# EasyEDA Pro project ProProject_RTOS瑞士军刀_.epro

# Schematic Schematic1
Create Date: 2023-12-15; Page Name: P1; Project Name: RTOS瑞士军刀; Schematic Name: Schematic1; Update Date: 2023-12-18; Company: 嘉立创EDA; Page Size: A4; Version: V1.0
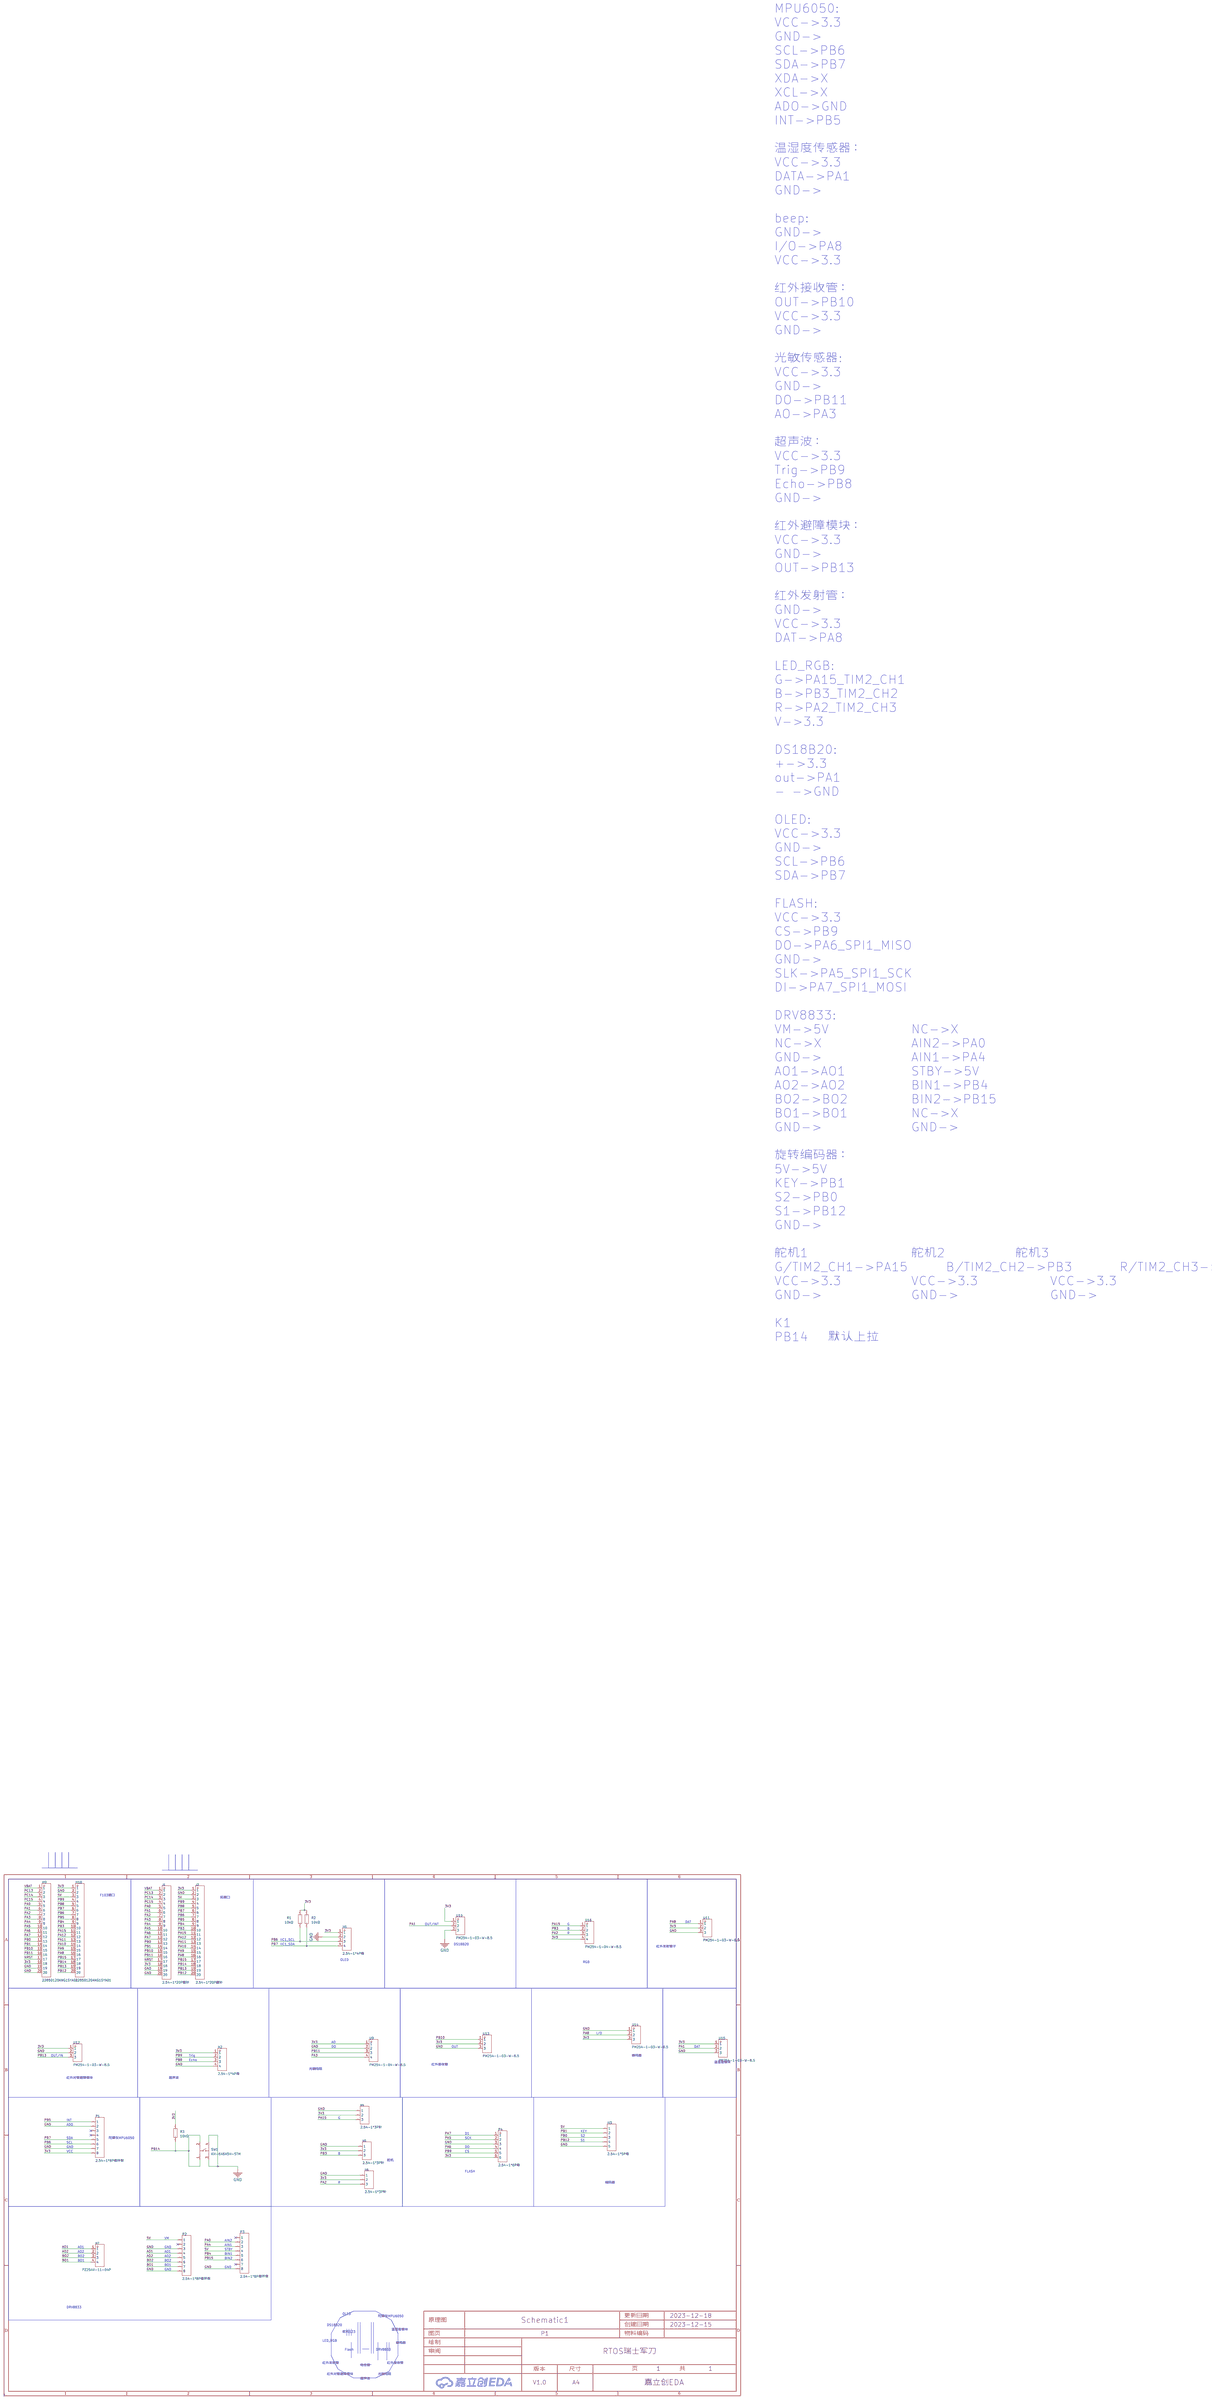
[diagram p0: schematic sheet]

## Parts
H1  2.54-1*4P母  [HDR-TH_4P-P2.54-V-F]
H2  2.54-1*4P母  [HDR-TH_4P-P2.54-V-F]
H3  2.54-1*5P母  [HDR-TH_5P-P2.54-V-F]
H4  2.54-1*3P针  [HDR-TH_3P-P2.54-V-M-1]
H5  2.54-1*3P针  [HDR-TH_3P-P2.54-V-M-1]
H6  2.54-1*3P针  [HDR-TH_3P-P2.54-V-M-1]
H7  PZ254V-11-04P  [HDR-TH_4P-P2.54-V-M]
H9  22850120ANG1SYA01  [HDR-TH_20P-P2.54-V-F]
H10  22850120ANG1SYA01  [HDR-TH_20P-P2.54-V-F]
J1  2.54-1*20P直针  [HDR-TH_20P-P2.54-V-M-1]
J2  2.54-1*20P直针  [HDR-TH_20P-P2.54-V-M-1]
P1  2.54-1*8P母环保  [HDR-TH_8P-P2.54-V-F-1]
P2  2.54-1*8P母环保  [HDR-TH_8P-P2.54-V-F-1]
P3  2.54-1*8P母环保  [HDR-TH_8P-P2.54-V-F-1]
P4  2.54-1*6P母  [HDR-TH_6P-P2.54-V-F]
R1  10kΩ  [R0603]
R2  10kΩ  [R0603]
R3  10kΩ  [R0603]
SW1  KH-6X6X5H-STM  [SW-SMD_4P-L6.0-W6.0-P4.50-LS9.0-2]
U9  PM254-1-04-W-8.5  [HDR-TH_4P-P2.54-H-F-W10.0-N]
U10  PM254-1-03-W-8.5  [HDR-TH_3P-P2.54-H-F-W10.0-N]
U11  PM254-1-03-W-8.5  [HDR-TH_3P-P2.54-H-F-W10.0-N]
U12  PM254-1-03-W-8.5  [HDR-TH_3P-P2.54-H-F-W10.0-N]
U13  PM254-1-03-W-8.5  [HDR-TH_3P-P2.54-H-F-W10.0-N]
U14  PM254-1-03-W-8.5  [HDR-TH_3P-P2.54-H-F-W10.0-N]
U15  PM254-1-03-W-8.5  [HDR-TH_3P-P2.54-H-F-W10.0-N]
U16  PM254-1-04-W-8.5  [HDR-TH_4P-P2.54-H-F-W10.0-N]

## Library data of the parts
H1 H2 = 2.54-1*4P母: 排数:单排;总孔位数:4P;间距:2.54mm;插孔结构:1x4P;行距:-;安装类型:直插;圆孔/方孔:方孔;额定电流:3A;额定电压:-;插孔方向:顶部;塑高:-;触头材质:青铜;触头镀层:-;工作温度范围:-40℃~+105℃;焊接温度(最大值):-;; LCSC Part Name: 间距:2.54mm 1x4P 直插; Supplier Part: C2718488; Manufacturer: BOOMELE(博穆精密); Supplier Footprint: 插件,P=2.54mm; JLCPCB Part Class: 扩展库; Datasheet: https://atta.szlcsc.com/upload/public/pdf/source/20210301/C2718488_F4427B881E42CAA8DDB0B1C12B3A522C.pdf; Supplier: LCSC; Number of Rows: 单排; Number of Holes: 4P; Pitch: 2.54mm; Holes Structure: 1x4P; Mounting Type: 直插; Circular Hole / Square Hole: 方孔; Current Rating (Max): 3A; Holes Direction: 顶部; Contact Material: 青铜; Operating Temperature Range: -40℃~+105℃
H3 = 2.54-1*5P母: 排数:单排;总孔位数:5P;间距:2.54mm;插孔结构:1x5P;行距:-;安装类型:直插;塑高:-;触头材质:-;触头镀层:-;; LCSC Part Name: 间距:2.54mm 1x5P 直插; Supplier Part: C50950; Manufacturer: BOOMELE(博穆精密); Supplier Footprint: 插件,P=2.54mm; JLCPCB Part Class: 扩展库; Datasheet: https://atta.szlcsc.com/upload/public/pdf/source/20210301/C2718488_F4427B881E42CAA8DDB0B1C12B3A522C.pdf; Supplier: LCSC; Number of Rows: 单排; Number of Holes: 5P; Pitch: 2.54mm; Holes Structure: 1x5P; Mounting Type: 直插
H4-H6 = 2.54-1*3P针: 排数:单排;总PIN位数:3;间距:2.54mm;插针结构:1x3P;行距:-;安装类型:直插;圆针/方针:方针;额定电流:3A;额定电压:-;配合针长度:-;塑高:-;端接针长度:-;触头材质:-;触头镀层:-;工作温度范围:-40℃~+105℃;颜色:黑色;; LCSC Part Name: 2.54mm 1x3P 直插 方针; Supplier Part: C49257; Manufacturer: BOOMELE(博穆精密); Supplier Footprint: 直插,P=2.54mm; JLCPCB Part Class: 扩展库; Supplier: LCSC; Number of Rows: 单排; Number of Pins: 3; Pitch: 2.54mm; Pin Structure: 1x3P; Mounting Type: 直插; Circluar Pins/Square Pins: 方针; Current Rating (Max): 3A; Operating Temperature Range: -40℃~+105℃; Color: 黑色
H7 = PZ254V-11-04P: 排数:单排;总PIN位数:4P;间距:2.54mm;插针结构:1x4P;行距:-;安装类型:直插;圆针/方针:方针;额定电流:3A;额定电压:250V;配合针长度:6mm;塑高:2.5mm;端接针长度:3mm;触头材质:-;工作温度范围:-40℃~+105℃;颜色:黑色;; LCSC Part Name: 2.54mm 1x4P 直插 方针; Supplier Part: C2691448; Manufacturer: XFCN(兴飞); Supplier Footprint: 插件,P=2.54mm; JLCPCB Part Class: 扩展库; Datasheet: https://atta.szlcsc.com/upload/public/pdf/source/20200309/C492403_F9F19131791D08044AD4F84F8E751A34.pdf; Supplier: LCSC; Number of Rows: 单排; Number of Pins: 4P; Pitch: 2.54mm; Pin Structure: 1x4P; Mounting Type: 直插; Circluar Pins/Square Pins: 方针; Current Rating (Max): 3A; Voltage Rating (Max): 250V; Length of Mating Pin: 6mm; Insulation Height: 2.5mm; Length of End Connection Pin: 3mm; Operating Temperature Range: -40℃~+105℃; Color: 黑色
H9 H10 = 22850120ANG1SYA01: 排数:单排;总孔位数:20P;间距:2.54mm;插孔结构:1x20P;行距:-;安装类型:直插;塑高:-;触头材质:黄铜;触头镀层:-;; LCSC Part Name: 间距:2.54mm 1x20P 直插; Supplier Part: C429947; Manufacturer: JILN(锦凌); Supplier Footprint: 插件,P=2.54mm; JLCPCB Part Class: 扩展库; Datasheet: https://atta.szlcsc.com/upload/public/pdf/source/20190920/C429966_F6288D72CB1EF194DAF75E8AC5D57877.pdf; Supplier: LCSC; Number of Rows: 单排; Number of Holes: 20P; Pitch: 2.54mm; Holes Structure: 1x20P; Mounting Type: 直插; Contact Material: 黄铜
J1 J2 = 2.54-1*20P直针: 排数:单排;总PIN位数:20;间距:2.54mm;插针结构:1x20P;行距:-;安装类型:直插;圆针/方针:方针;额定电流:3A;额定电压:-;配合针长度:-;塑高:-;端接针长度:-;触头材质:黄铜;触头镀层:-;工作温度范围:-40℃~+105℃;颜色:黑色;; LCSC Part Name: 2.54mm 1x20P 直插 方针; Supplier Part: C50981; Manufacturer: BOOMELE(博穆精密); Supplier Footprint: 直插,P=2.54mm; JLCPCB Part Class: 扩展库; Supplier: LCSC; Number of Rows: 单排; Number of Pins: 20; Pitch: 2.54mm; Pin Structure: 1x20P; Mounting Type: 直插; Circluar Pins/Square Pins: 方针; Current Rating (Max): 3A; Contact Material: 黄铜; Operating Temperature Range: -40℃~+105℃; Color: 黑色
P1-P3 = 2.54-1*8P母环保: 排数:单排;总孔位数:8P;间距:2.54mm;插孔结构:1x8P;行距:-;安装类型:直插;塑高:-;触头材质:-;触头镀层:-;; LCSC Part Name: 间距:2.54mm 1x8P 直插; Supplier Part: C27438; Manufacturer: BOOMELE(博穆精密); Supplier Footprint: 插件,P=2.54mm; JLCPCB Part Class: 扩展库; Datasheet: https://atta.szlcsc.com/upload/public/pdf/source/20210301/C2718488_F4427B881E42CAA8DDB0B1C12B3A522C.pdf; Supplier: LCSC; Number of Rows: 单排; Number of Holes: 8P; Pitch: 2.54mm; Holes Structure: 1x8P; Mounting Type: 直插
P4 = 2.54-1*6P母: 排数:单排;总孔位数:6P;间距:2.54mm;插孔结构:1x6P;行距:-;安装类型:直插;塑高:-;触头材质:-;触头镀层:-;; LCSC Part Name: 间距:2.54mm 1x6P 直插; Supplier Part: C40877; Manufacturer: BOOMELE(博穆精密); Supplier Footprint: 插件,P=2.54mm; JLCPCB Part Class: Extended Part; Datasheet: https://atta.szlcsc.com/upload/public/pdf/source/20210301/C2718488_F4427B881E42CAA8DDB0B1C12B3A522C.pdf; Supplier: LCSC; Number of Rows: 单排; Number of Holes: 6P; Pitch: 2.54mm; Holes Structure: 1x6P; Mounting Type: 直插
R1-R3 = 0603WAF1002T5E: 阻值:10kΩ;精度:±1%;功率:100mW;温度系数:±100ppm/℃;电阻类型:厚膜电阻;; LCSC Part Name: 10kΩ ±1% 100mW 厚膜电阻; Supplier Part: C25804; Manufacturer: UNI-ROYAL(厚声); Supplier Footprint: 0603; JLCPCB Part Class: 基础库; Datasheet: https://atta.szlcsc.com/upload/public/pdf/source/20200306/C422600_1E6D84923E4A46A82E41ADD87F860B5C.pdf; Supplier: LCSC; Tolerance: ±1%; Power(Watts): 100mW; Overload Voltage (Max): 75V; Temperature Coefficient: ±100ppm/℃; Type: 厚膜电阻; Operating Temperature Range: -55℃~+155℃
SW1 = KH-6X6X5H-STM: 电路结构:单刀单掷;带支架:否;触点电流:50mA;额定电压(DC):12V;安装方式:立贴;机械寿命:8万次;; LCSC Part Name: 6*6*5mm 立贴 轻触开关; Supplier Part: C2837531; Manufacturer: kinghelm(金航标); Supplier Footprint: SMD; JLCPCB Part Class: 扩展库; Datasheet: https://atta.szlcsc.com/upload/public/pdf/source/20210608/C2837531_45E87AB996CE723B09405FF2EA209C4C.pdf; Supplier: LCSC; Circuit: 单刀单掷; Actuator Style: 圆形按钮; Switch Length: 6mm; Switch Width: 6mm; Switch Height: 5mm; Strike Gundam: 否; Contact Current: 50mA; Voltage Rating (DC): 12V; Mounting Style: 立贴; Actuator/Cap Color: 黑色; Pin Style: 鸥翼型; Mechanical Life: 8万次
U9 U16 = PM254-1-04-W-8.5: 插孔结构:1x4P;间距:2.54mm;总孔位数:4P;安装类型:弯插;排数:单排;行距:-;圆孔/方孔:方孔;额定电流:3A;额定电压:-;插孔方向:侧面;塑高:8.5mm;工作温度范围:-40℃~+105℃;; LCSC Part Name: 间距:2.54mm 1x4P 弯插; Supplier Part: C2897386; Manufacturer: HCTL(华灿天禄); Supplier Footprint: 弯插,P=2.54mm; JLCPCB Part Class: 扩展库; Datasheet: https://atta.szlcsc.com/upload/public/pdf/source/20230609/7BA40A3D721268A082DCDEAD4C99131B.pdf; Supplier: LCSC; Holes Structure: 1x4P; Pitch: 2.54mm; Number of Holes: 4P; Mounting Type: 弯插; Number of Rows: 单排; Circular Hole / Square Hole: 方孔; Current Rating (Max): 3A; Holes Direction: 侧面; Insulation Height: 8.5mm; Operating Temperature Range: -40℃~+105℃
U10-U15 = PM254-1-03-W-8.5: 排数:单排;总孔位数:3P;间距:2.54mm;插孔结构:1x3P;行距:-;安装类型:弯插;圆孔/方孔:方孔;额定电流:3A;额定电压:-;插孔方向:侧面;塑高:8.5mm;工作温度范围:-40℃~+105℃;; LCSC Part Name: 间距:2.54mm 1x3P 弯插; Supplier Part: C2897385; Manufacturer: HCTL(华灿天禄); Supplier Footprint: 弯插,P=2.54mm; JLCPCB Part Class: 扩展库; Datasheet: https://atta.szlcsc.com/upload/public/pdf/source/20230609/7BA40A3D721268A082DCDEAD4C99131B.pdf; Supplier: LCSC; Number of Rows: 单排; Number of Holes: 3P; Pitch: 2.54mm; Holes Structure: 1x3P; Mounting Type: 弯插; Circular Hole / Square Hole: 方孔; Current Rating (Max): 3A; Holes Direction: 侧面; Insulation Height: 8.5mm; Operating Temperature Range: -40℃~+105℃

## Nets
3V3: H1.1 H2.1 H4.2 H5.2 H6.2 H9.18 H10.1 J1.18 J2.1 P1.8 P4.6 R1.2 R2.2 R3.2 U9.1 U10.1 U11.2 U12.1 U13.2 U14.3 U15.1 U16.4
5V: H3.1 H10.3 J2.3 P2.1 P3.4
GND: H1.2 H2.4 H3.5 H4.1 H5.1 H6.1 H9.19 H9.20 H10.2 J1.19 J1.20 J2.2 P1.2 P1.7 P2.3 P2.8 P3.8 P4.3 SW1.3 SW1.4 U9.2 U10.3 U11.3 U12.2 U13.3 U14.1 U15.3
VBAT: H9.1 J1.1
AO1: H7.1 P2.4
AO2: H7.2 P2.5
BO1: H7.4 P2.7
BO2: H7.3 P2.6
NRST: H9.17 J1.17
PA0: H9.5 J1.5 P3.2
PA1: H9.6 J1.6 U10.2 U15.2
PA2: H6.3 H9.7 J1.7 U16.3
PA3: H9.8 J1.8 U9.4
PA4: H9.9 J1.9 P3.3
PA5: H9.10 J1.10 P4.2
PA6: H9.11 J1.11 P4.4
PA7: H9.12 J1.12 P4.1
PA8: H10.16 J2.16 U11.1 U14.2
PA9: H10.15 J2.15
PA10: H10.14 J2.14
PA11: H10.13 J2.13
PA12: H10.12 J2.12
PA15: H4.3 H10.11 J2.11 U16.1
PB0: H3.3 H9.13 J1.13
PB1: H3.2 H9.14 J1.14
PB3: H5.3 H10.10 J2.10 U16.2
PB4: H10.9 J2.9 P3.5
PB5: H10.8 J2.8 P1.1
PB6: H1.3 H10.7 J2.7 P1.6 R1.1
PB7: H1.4 H10.6 J2.6 P1.5 R2.1
PB8: H2.3 H10.5 J2.5
PB9: H2.2 H10.4 J2.4 P4.5
PB10: H9.15 J1.15 U13.1
PB11: H9.16 J1.16 U9.3
PB12: H3.4 H10.20 J2.20
PB13: H10.19 J2.19 U12.3
PB14: H10.18 J2.18 R3.1 SW1.1 SW1.2
PB15: H10.17 J2.17 P3.6
PC13: H9.2 J1.2
PC14: H9.3 J1.3
PC15: H9.4 J1.4

Not connected (* = marked no-connect by the designer): P1 3* 4*; P2 2*; P3 1* 7*

## Notes on the sheet
- MPU6050:
  VCC->3.3
  GND->
  SCL->PB6
  SDA->PB7
  XDA->X
  XCL->X
  ADO->GND
  INT->PB5
  温湿度传感器：
  VCC->3.3
  DATA->PA1
  GND->
  beep:
  GND->
  I/O->PA8
  VCC->3.3
  红外接收管：
  OUT->PB10
  VCC->3.3
  GND->
  光敏传感器:
  VCC->3.3
  GND->
  DO->PB11
  AO->PA3
  超声波：
  VCC->3.3
  Trig->PB9
  Echo->PB8
  GND->
  红外避障模块：
  VCC->3.3
  GND->
  OUT->PB13
  红外发射管：
  GND->
  VCC->3.3
  DAT->PA8
  LED_RGB:
  G->PA15_TIM2_CH1
  B->PB3_TIM2_CH2
  R->PA2_TIM2_CH3
  V->3.3
  DS18B20:
  +->3.3
  out->PA1
  - ->GND
  OLED:
  VCC->3.3
  GND->
  SCL->PB6
  SDA->PB7
  FLASH:
  VCC->3.3
  CS->PB9
  DO->PA6_SPI1_MISO
  GND->
  SLK->PA5_SPI1_SCK
  DI->PA7_SPI1_MOSI
  DRV8833:
  VM->5V			NC->X
  NC->X			AIN2->PA0
  GND->			AIN1->PA4
  AO1->AO1		STBY->5V
  AO2->AO2		BIN1->PB4
  BO2->BO2		BIN2->PB15
  BO1->BO1		NC->X
  GND->			GND->
  旋转编码器：
  5V->5V
  KEY->PB1
  S2->PB0
  S1->PB12
  GND->
  舵机1			舵机2			舵机3
  G/TIM2_CH1->PA15	B/TIM2_CH2->PB3		R/TIM2_CH3->PA2
  VCC->3.3		VCC->3.3		VCC->3.3
  GND->			GND->			GND->
  K1
  PB14   默认上拉
- F103插口
- 拓展口
- OUT/INT
- G
- DAT
- B
- R
- IIC1_SCL
- IIC1_SDA
- DS18B20
- 红外发射管子
- OLED
- RGB
- I/O
- AO
- DO
- OUT
- DAT
- OUT/IN
- Trig
- 蜂鸣器
- Echo
- 红外接收管
- 温湿度模块
- 光敏电阻
- 红外对管避障模块
- 超声波
- G
- ADO
- INT
- D1
- KEY
- SDA
- 陀螺仪MPU6050
- SCK
- S1
- S2
- SCL
- GND
- DO
- VCC
- B
- CS
- 舵机
- FLASH
- R
- 编码器
- VM
- AIN2
- AIN1
- AO1
- GND
- STBY
- AO2
- BO2
- AO1
- AO2
- BIN1
- BO1
- BO2
- BIN2
- BO1
- GND
- GND
- DRV8833
- OLED
- 陀螺仪MPU6050
- DS18B20
- 温湿度模块
- 舵机123
- LED_RGB
- 蜂鸣器
- Flash
- DRV8833
- 红外发射管
- 电位器
- 红外接收管
- 红外对管避障模块
- 光敏电阻
- 超声波

# Board PCB1
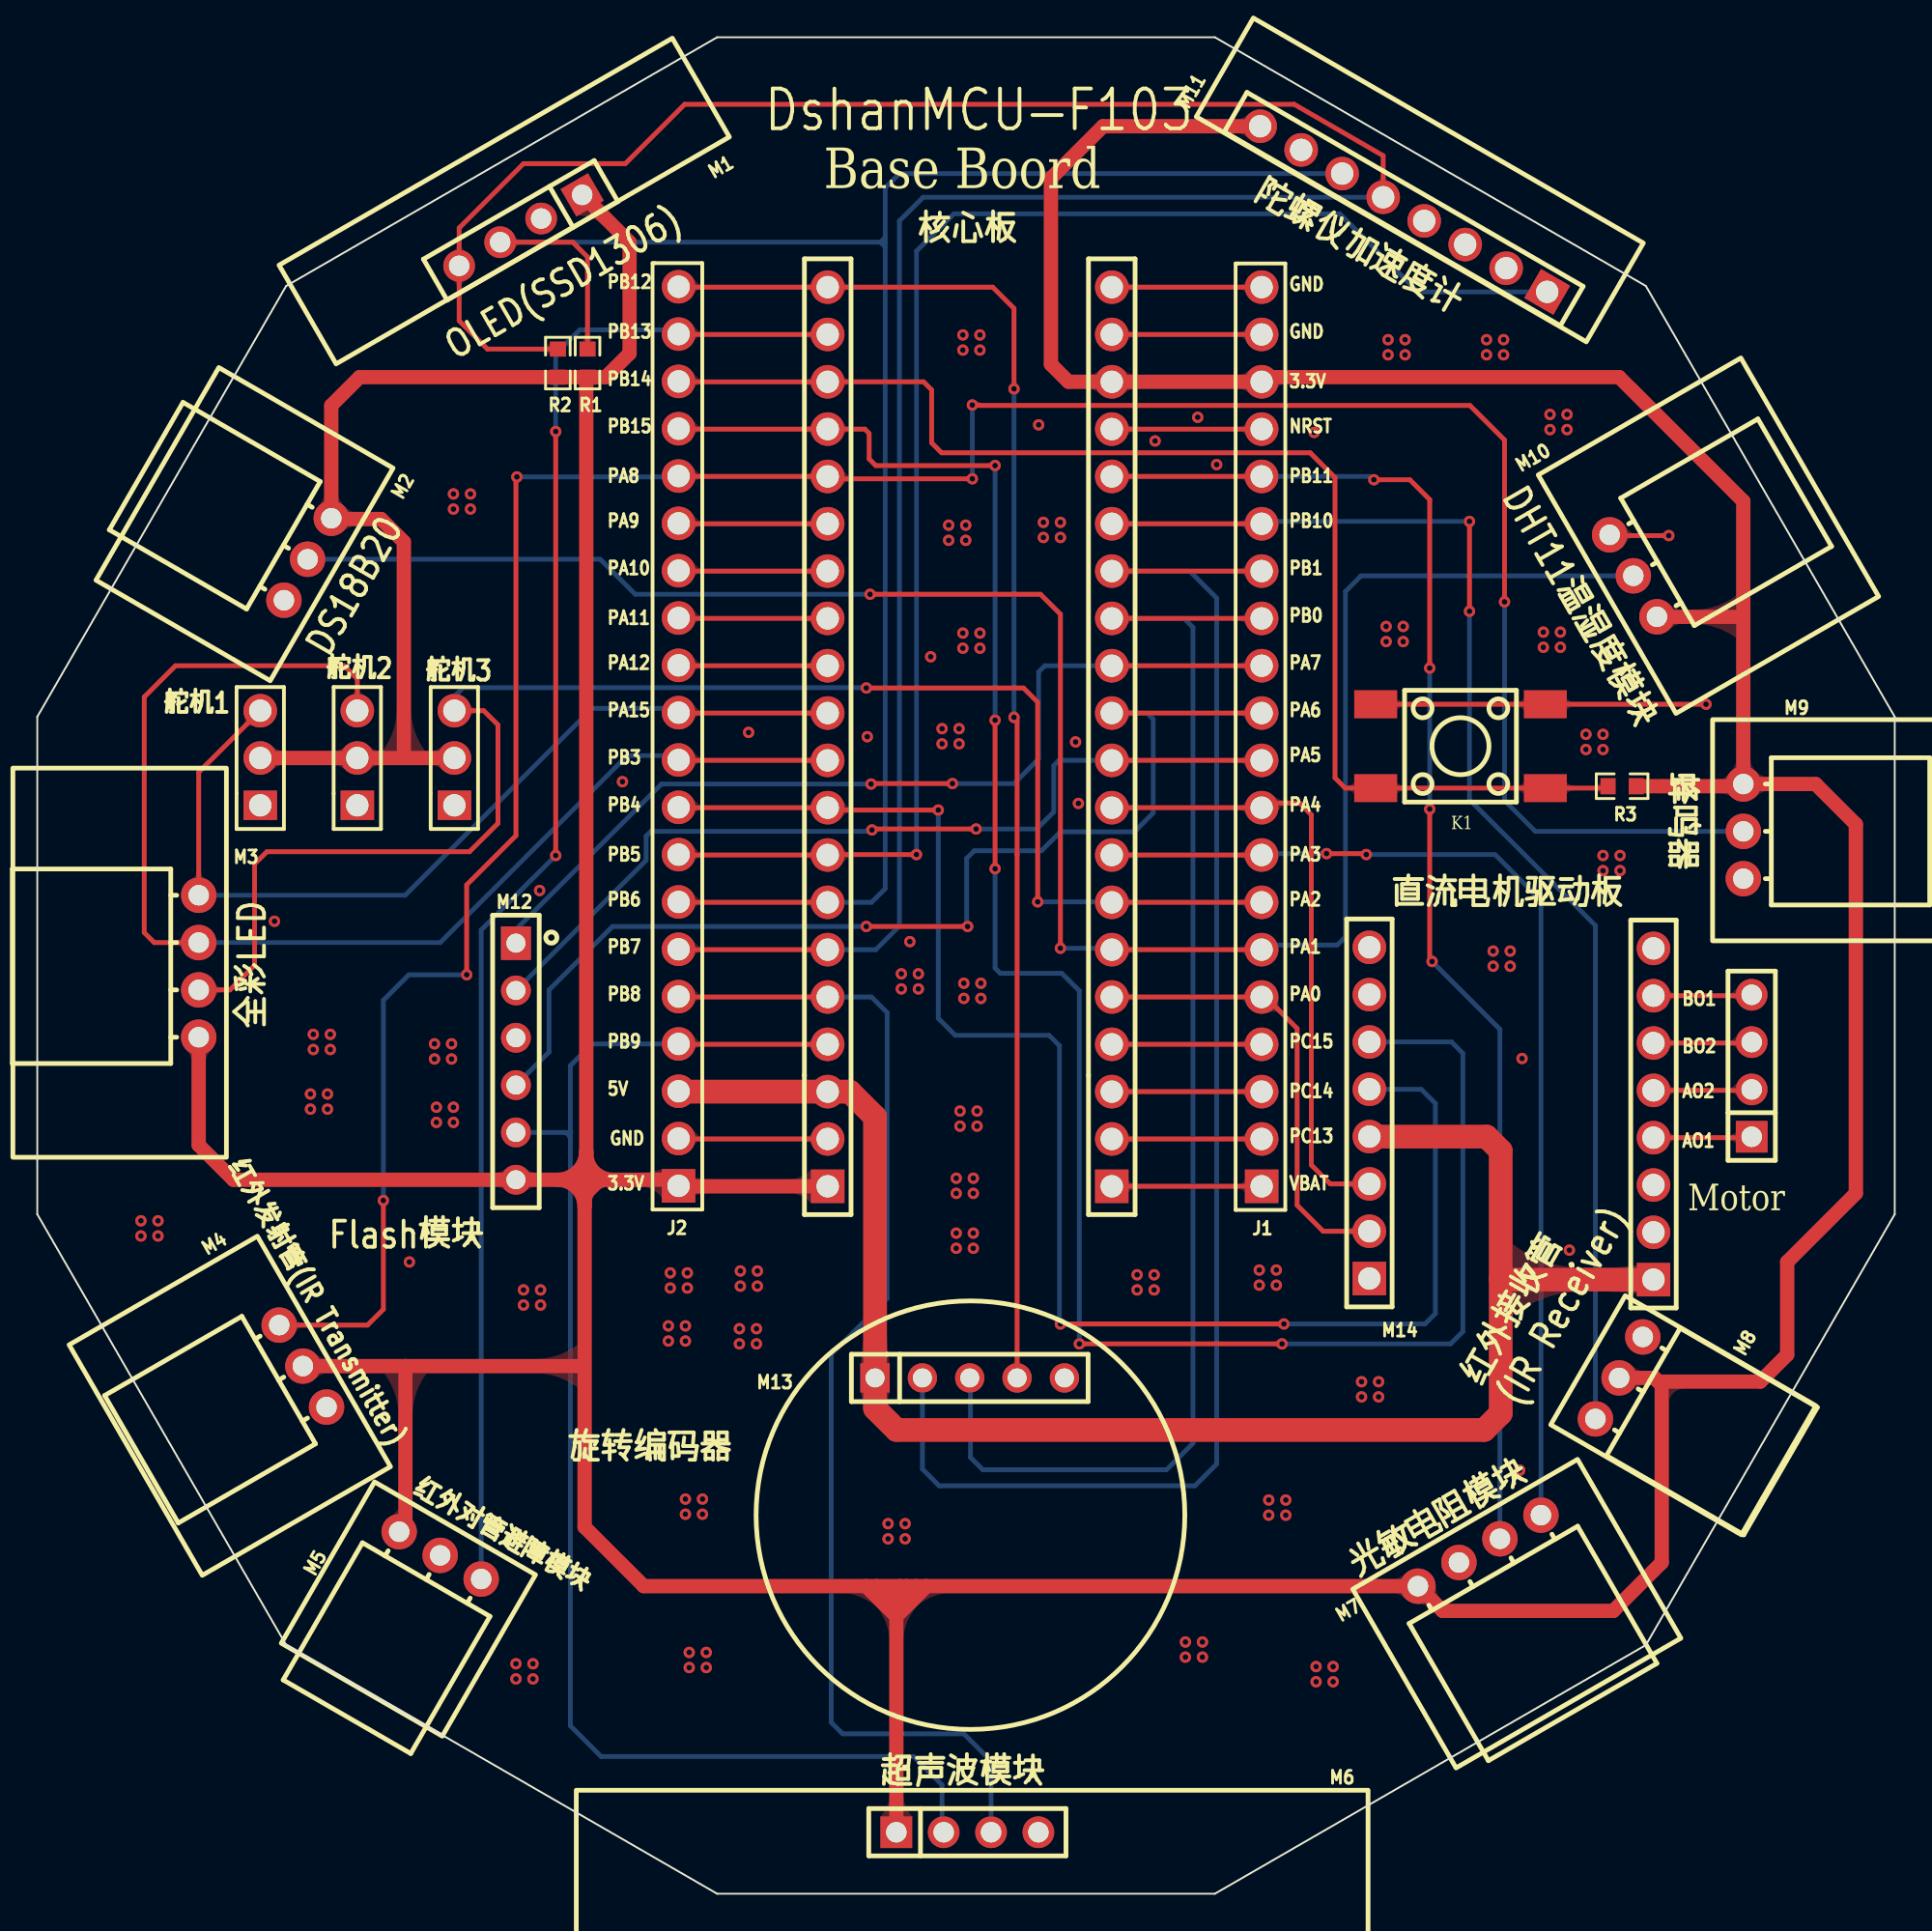
[diagram p1: board, top side]
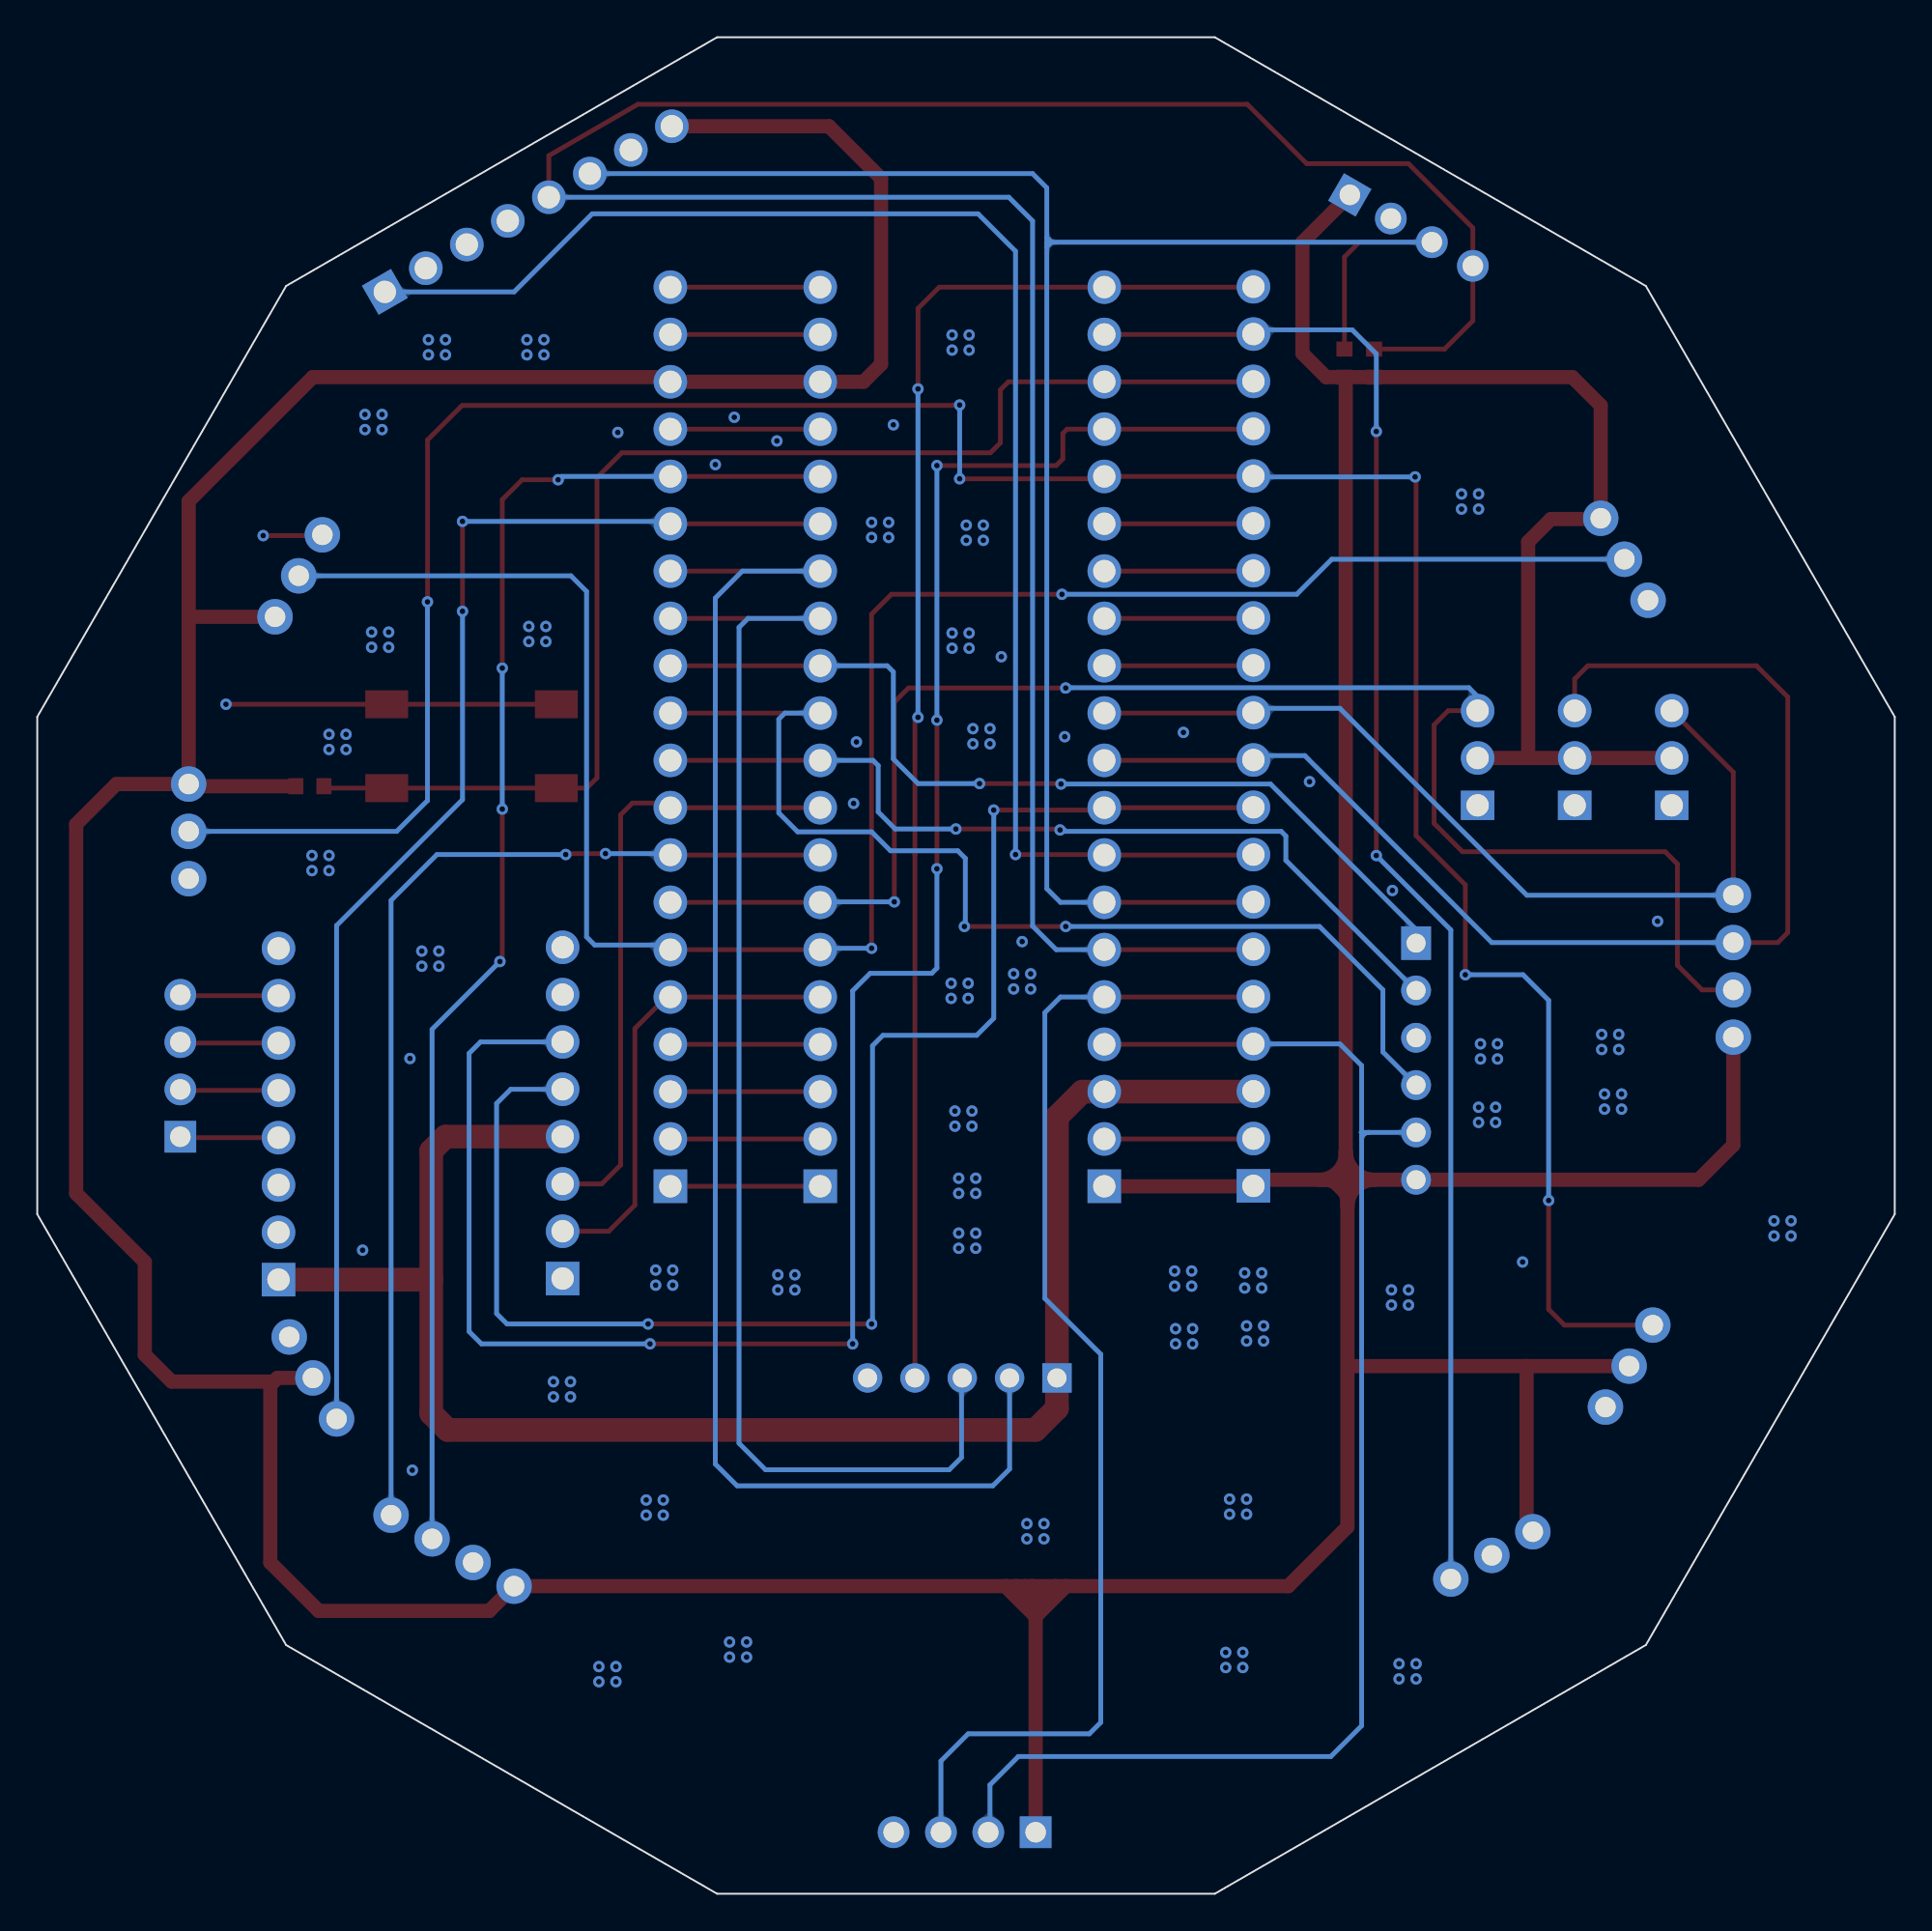
[diagram p2: board, bottom side, seen from below]

Outline 99.65 x 99.65 mm; copper layers: Top Layer, Bottom Layer. Coordinates in mm from the lower left corner of the outline.
Outline path: 0,63.17 0,36.47 13.35,13.35 36.47,0 63.17,0 86.3,13.35 99.65,36.47 99.65,63.17 86.3,86.3 63.17,99.65 36.47,99.65 13.35,86.3 0,63.17
Stack: Top Layer 0.035mm / Dielectric1 1.51mm FR4 er 4.5 / Bottom Layer 0.035mm

## Design rules (mm)
template: JLCPCB Capability(Two Layers Board)
spacing copperThickness1oz (default): track to track 0.102, other pairs 0.152 to 0.3
spacing copperThickness2oz: track to track 0.203, other pairs 0.152 to 0.3
track width copperThickness1oz (default): min 0.127, default 0.254, max 2.54
track width copperThickness2oz: min 0.203, default 0.254, max 2.54
differential pair differentialPair (default): width min 0.127, default 0.254, max 2.54; gap min 0.152, default 0.152
via viaSize (default): diameter min 0.5, default 0.61, max 10; hole min 0.3, default 0.305, max 6.3

## Placement (name value [footprint] x y rotation side)
H4  2.54-1*3P针  [HDR-TH_3P-P2.54-V-M-1]  11.96 60.96 90 top
H5  2.54-1*3P针  [HDR-TH_3P-P2.54-V-M-1]  17.17 60.96 90 top
H6  2.54-1*3P针  [HDR-TH_3P-P2.54-V-M-1]  22.38 60.96 90 top
H7  PZ254V-11-04P  [HDR-TH_4P-P2.54-V-M]  91.97 44.44 90 top
H9  22850120ANG1SYA01  [HDR-TH_20P-P2.54-V-F]  57.64 62.1 90 top
H10  22850120ANG1SYA01  [HDR-TH_20P-P2.54-V-F]  42.4 62.1 90 top
J1  2.54-1*20P直针  [HDR-TH_20P-P2.54-V-M-1]  65.68 62.1 90 top
J2  2.54-1*20P直针  [HDR-TH_20P-P2.54-V-M-1]  34.4 62.12 90 top
M1  2.54-1*4P母  [HDR-TH_4P-P2.54-V-F]  25.93 89.28 210 top
M2  PM254-1-03-W-8.5  [HDR-TH_3P-P2.54-H-F-W10.0-N]  14.5 71.63 240 top
M3  PM254-1-04-W-8.5  [HDR-TH_4P-P2.54-H-F-W10.0-N]  8.66 49.78 270 top
M4  PM254-1-03-W-8.5  [HDR-TH_3P-P2.54-H-F-W10.0-N]  14.25 28.32 300 top
M5  PM254-1-03-W-8.5  [HDR-TH_3P-P2.54-H-F-W10.0-N]  21.61 18.16 330 top
M6  2.54-1*4P母  [HDR-TH_4P-P2.54-V-F]  49.9 3.3 0 top
M7  PM254-1-04-W-8.5  [HDR-TH_4P-P2.54-H-F-W10.0-N]  77.37 18.41 30 top
M8  PM254-1-03-W-8.5  [HDR-TH_3P-P2.54-H-F-W10.0-N]  84.86 27.69 60 top
M9  PM254-1-03-W-8.5  [HDR-TH_3P-P2.54-H-F-W10.0-N]  91.53 57.02 90 top
M10  PM254-1-03-W-8.5  [HDR-TH_3P-P2.54-H-F-W10.0-N]  85.62 70.74 120 top
M11  2.54-1*8P母环保  [HDR-TH_8P-P2.54-V-F-1]  73.3 90.42 150 top
M12  2.54-1*6P母  [HDR-TH_6P-P2.54-V-F]  25.68 44.67 270 top
M13  2.54-1*5P母  [HDR-TH_5P-P2.54-V-F]  50.02 27.69 0 top
M14  2.54-1*8P母环保  [HDR-TH_8P-P2.54-V-F-1]  71.46 41.91 90 top
P2  2.54-1*8P母环保  [HDR-TH_8P-P2.54-V-F-1]  86.7 41.85 90 top
R1  10kΩ  [R0603]  29.52 82.16 270 top
R2  10kΩ  [R0603]  27.93 82.16 270 top
R3  10kΩ  [R0603]  85.02 59.45 0 top
SW1  KH-6X6X5H-STM  [SW-SMD_4P-L6.0-W6.0-P4.50-LS9.0-2]  76.35 61.59 180 top

## Footprints (pads in the part's own frame, mm; a bottom-side part is the same pattern mirrored in y, then rotated)
HDR-TH_3P-P2.54-H-F-W10.0-N
  round 1.9 hole 1.1: 1(-2.54,0) 2(0,0) 3(2.54,0)
HDR-TH_3P-P2.54-V-M-1
  rect 1.575x1.8 hole 1.2: 1(-2.54,0)
  round 1.8 hole 1.2: 2(0,0) 3(2.54,0)
HDR-TH_4P-P2.54-H-F-W10.0-N
  round 1.9 hole 1.1: 1(-3.81,0) 2(-1.27,0) 3(1.27,0) 4(3.81,0)
HDR-TH_4P-P2.54-V-F
  rect 1.7x1.7 hole 1.1: 1(-3.81,0)
  round 1.7 hole 1.1: 2(-1.27,0) 3(1.27,0) 4(3.81,0)
HDR-TH_4P-P2.54-V-M
  rect 1.7x1.7 hole 1.1: 1(-3.81,0)
  round 1.7 hole 1.1: 2(-1.27,0) 3(1.27,0) 4(3.81,0)
HDR-TH_5P-P2.54-V-F
  rect 1.575x1.575 hole 1.02: 1(-5.08,0)
  round 1.575 hole 1.02: 2(-2.54,0) 3(0,0) 4(2.54,0) 5(5.08,0)
HDR-TH_6P-P2.54-V-F
  rect 1.8x1.6 hole 1.02: 1(-6.35,0)
  round 1.6 hole 1.02: 2(-3.81,0) 3(-1.27,0) 4(1.27,0) 5(3.81,0) 6(6.35,0)
HDR-TH_8P-P2.54-V-F-1
  rect 1.8x1.8 hole 1.2: 1(-8.89,0)
  round 1.8 hole 1.2: 2(-6.35,0) 3(-3.81,0) 4(-1.27,0) 5(1.27,0) 6(3.81,0) 7(6.35,0) 8(8.89,0)
HDR-TH_20P-P2.54-V-F
  rect 1.8x1.8 hole 1.2: 1(-24.13,0)
  round 1.8 hole 1.2: 2(-21.59,0) 3(-19.05,0) 4(-16.51,0) 5(-13.97,0) 6(-11.43,0) 7(-8.89,0) 8(-6.35,0) 9(-3.81,0) 10(-1.27,0) 11(1.27,0) 12(3.81,0) 13(6.35,0) 14(8.89,0) 15(11.43,0) 16(13.97,0) 17(16.51,0) 18(19.05,0) 19(21.59,0) 20(24.13,0)
HDR-TH_20P-P2.54-V-M-1
  rect 1.8x1.8 hole 1.2: 1(-24.13,0)
  round 1.8 hole 1.2: 2(-21.59,0) 3(-19.05,0) 4(-16.51,0) 5(-13.97,0) 6(-11.43,0) 7(-8.89,0) 8(-6.35,0) 9(-3.81,0) 10(-1.27,0) 11(1.27,0) 12(3.81,0) 13(6.35,0) 14(8.89,0) 15(11.43,0) 16(13.97,0) 17(16.51,0) 18(19.05,0) 19(21.59,0) 20(24.13,0)
R0603
  rect 0.806x0.864 smd: 1(-0.753,0) 2(0.753,0)
SW-SMD_4P-L6.0-W6.0-P4.50-LS9.0-2
  rect 2.3x1.5 smd: 1(-4.55,2.25) 2(4.55,2.25) 3(-4.55,-2.25) 4(4.55,-2.25)

## Nets
3V3: H4.2 H5.2 H6.2 H9.18 H10.1 J1.18 J2.1 M1.1 M2.1 M3.4 M4.2 M5.1 M6.1 M7.1 M8.2 M9.3 M10.1 M11.8 M12.6 R1.2 R2.2 R3.2
5V: H10.3 J2.3 M13.1 M14.4 P2.1
GND: H4.1 H5.1 H6.1 H9.19 H9.20 H10.2 J1.19 J1.20 J2.2 M1.2 M2.3 M4.3 M5.2 M6.4 M7.2 M8.3 M9.1 M10.3 M11.2 M11.7 M12.3 M13.5 M14.8 P2.3 P2.8 SW1.3 SW1.4
VBAT: H9.1 J1.1
AO1: H7.1 P2.4
AO2: H7.2 P2.5
BO1: H7.4 P2.7
BO2: H7.3 P2.6
NRST: H9.17 J1.17
PA0: H9.5 J1.5 M14.2
PA1: H9.6 J1.6 M2.2 M10.2
PA2: H6.3 H9.7 J1.7 M3.3
PA3: H9.8 J1.8 M7.4
PA4: H9.9 J1.9 M14.3
PA5: H9.10 J1.10 M12.2
PA6: H9.11 J1.11 M12.4
PA7: H9.12 J1.12 M12.1
PA8: H10.16 J2.16 M4.1 M9.2
PA9: H10.15 J2.15
PA10: H10.14 J2.14
PA11: H10.13 J2.13
PA12: H10.12 J2.12
PA15: H4.3 H10.11 J2.11 M3.1
PB0: H9.13 J1.13 M13.3
PB1: H9.14 J1.14 M13.2
PB3: H5.3 H10.10 J2.10 M3.2
PB4: H10.9 J2.9 M14.5
PB5: H10.8 J2.8 M11.1
PB6: H10.7 J2.7 M1.3 M11.6 R1.1
PB7: H10.6 J2.6 M1.4 M11.5 R2.1
PB8: H10.5 J2.5 M6.3
PB9: H10.4 J2.4 M6.2 M12.5
PB10: H9.15 J1.15 M8.1
PB11: H9.16 J1.16 M7.3
PB12: H10.20 J2.20 M13.4
PB13: H10.19 J2.19 M5.3
PB14: H10.18 J2.18 R3.1 SW1.1 SW1.2
PB15: H10.17 J2.17 M14.6
PC13: H9.2 J1.2
PC14: H9.3 J1.3
PC15: H9.4 J1.4

Pads without a net: M11 3 4; M14 1 7; P2 2

## Via types
v1: diameter 0.61, hole 0.305, Top Layer to Bottom Layer, 213 vias

## Routing (per net, layer and track width the routed paths; a pad name or vN(x,y) marks a point on that pad's centre or on a via; arc(x,y) is an arc through that point)
3V3: length 425.3
  Top Layer w0.254: 17.55,60.96 H5.2 ; 34.3,38.32 34.4,38.22
  Top Layer w0.762: 19.67,60.96 H6.2 ; 19.67,60.96 19.67,72.56 18.44,73.79 15.81,73.79 M2.1 15.77,79.88 17.29,81.4 R2.2 29.45,81.4 ; 19.67,60.96 17.55,60.96 ; 29.36,37.52 29.36,38.32 ; 29.36,37.52 28.56,38.32 ; 29.36,37.52 29.51,37.67 ; 29.36,37.52 29.36,37.08 ; 29.36,38.32 28.56,38.32 ; 29.36,38.32 29.36,38.63 29.45,38.72 ; 29.45,38.94 29.45,38.72 ; 29.45,38.94 30.07,38.32 ; 29.45,38.94 29.45,39.18 ; 29.45,38.72 29.45,38.41 29.36,38.32 30.07,38.32 ; 29.45,39.86 29.45,39.75 ; 29.45,39.86 29.45,81.4 ; 29.45,39.86 arc(29,38.77) 27.91,38.32 ; 29.45,39.75 29.45,39.18 ; 29.45,39.75 arc(29.87,38.74) 30.88,38.32 ; 29.45,39.18 28.88,38.61 ; 45.03,16.51 44.46,16.51 ; 45.03,16.51 46.28,16.51 ; 45.03,16.51 46.09,15.46 ; 44.46,16.51 32.54,16.51 29.36,19.69 29.36,36.88 ; 44.46,16.51 46.09,14.88 ; M11.8 57.17,94.87 54.38,92.08 54.38,82.09 55.32,81.15 H9.18 65.39,81.15 65.64,81.4 84.86,81.4 91.53,74.74 91.53,68.58 ; M9.3 91.41,59.45 R3.2 ; M9.3 95.4,59.56 97.56,57.4 97.56,37.59 93.88,33.91 93.88,28.93 92.43,27.49 86.96,27.49 ; M9.3 91.53,68.58 ; 27.91,38.32 M12.6 10.52,38.32 8.66,40.18 M3.4 ; 27.91,38.32 28.56,38.32 ; 27.91,38.32 arc(28.94,37.9) 29.36,36.88 ; 46.28,16.51 46.09,16.32 46.09,15.46 ; 46.28,16.51 46.63,16.51 ; 30.6,38.32 30.88,38.32 ; 30.6,38.32 30.07,38.32 ; 30.6,38.32 arc(30.3,38.29) 30.02,38.18 ; 30.88,38.32 34.3,38.32 ; 47.14,16.51 47.69,16.51 ; 47.14,16.51 46.63,16.51 ; 47.14,16.51 46.89,16.26 ; 47.69,16.51 47.69,16.48 46.09,14.88 ; 47.69,16.51 M7.1 75.4,15.18 84.54,15.18 87.15,17.78 87.15,27.31 86.96,27.49 ; 46.09,14.88 M6.1 ; 46.09,14.88 46.09,15.46 ; 86.96,27.49 86.77,27.69 M8.2 ; 46.63,16.51 46.89,16.26 ; M5.1 19.75,19.77 19.75,28.32 ; 46.09,15.46 46.89,16.26 ; 29.45,81.4 R1.2 30.5,81.4 31.77,82.68 31.77,88.64 M1.1 ; 91.53,68.58 91.48,68.54 M10.1 ; 30.07,38.32 30.07,38.23 30.02,38.18 ; 29.51,37.67 30.02,38.18 ; 29.51,37.67 arc(29.4,37.38) 29.36,37.08 ; 29.51,37.67 arc(29.73,37.96) 30.02,38.18 ; 29.36,37.08 29.36,36.88 ; H10.1 34.65,37.97 34.4,38.22 ; 19.75,28.32 29.11,28.32 ; 19.75,28.32 M4.2 ; H4.2 H5.2
5V: length 90.9
  Top Layer w1.27: 78.51,32.98 78.53,32.96 P2.1 ; 78.51,32.98 78.51,25.78 77.62,24.89 46.1,24.89 44.94,26.05 M13.1 44.94,41.69 43.59,43.05 H10.3 34.65,43.05 34.4,43.3 ; 78.51,32.98 78.51,39.88 77.75,40.64 M14.4
GND: length 45.3
  Top Layer w0.254: SW1.4 SW1.3 v1(89.52,63.84) 89.56,63.88 ; 65.64,83.94 65.39,83.69 H9.19 ; v1(87.53,72.9) 84.39,72.9 M10.3 ; 34.4,40.76 34.65,40.51 H10.2 ; H9.20 65.39,86.23 65.64,86.48
  vias: v1(5.56,36.12) v1(5.56,35.31) v1(6.48,36.12) v1(6.48,35.31) v1(12.72,52.2) v1(14.65,42.93) v1(14.65,42.11) v1(14.81,46.13) v1(14.81,45.31) v1(15.57,42.93) v1(15.57,42.11) v1(15.72,46.13) v1(15.72,45.31) v1(19.96,33.91) v1(21.31,45.62) v1(21.31,44.81) v1(21.41,42.22) v1(21.41,41.4) v1(22.22,45.62) v1(22.22,44.81) v1(22.33,75.13) v1(22.33,74.32) v1(22.33,42.22) v1(22.33,41.4) v1(23.24,75.13) v1(23.24,74.32) v1(25.68,12.34) v1(25.68,11.53) v1(26.08,32.41) v1(26.08,31.6) v1(26.59,12.34) v1(26.59,11.53) v1(26.95,53.85) v1(27,32.41) v1(27,31.6) v1(31.39,59.69) v1(33.86,30.48) v1(33.86,29.67) v1(33.96,33.33) v1(33.96,32.51) v1(34.77,30.48) v1(34.77,29.67) v1(34.77,21.18) v1(34.77,20.37) v1(34.87,33.33) v1(34.87,32.51) v1(34.97,12.95) v1(34.97,12.14) v1(35.69,21.18) v1(35.69,20.37) v1(35.89,12.95) v1(35.89,12.14) v1(37.67,30.33) v1(37.67,29.52) v1(37.72,33.43) v1(37.72,32.61) v1(38.16,62.33) v1(38.63,33.43) v1(38.63,32.61) v1(38.58,30.33) v1(38.58,29.52) v1(44.53,62.1) v1(45.64,19.86) v1(45.64,19.05) v1(46.35,49.38) v1(46.35,48.56) v1(46.56,19.86) v1(46.56,19.05) v1(46.81,51.11) v1(47.27,49.38) v1(47.27,48.56) v1(47.93,66.4) v1(48.54,62.53) v1(48.54,61.72) v1(48.89,73.46) v1(48.89,72.64) v1(49.3,38.41) v1(49.3,37.59) v1(49.3,35.46) v1(49.3,34.65) v1(49.45,62.53) v1(49.45,61.72) v1(49.5,42.01) v1(49.5,41.2) v1(49.66,83.67) v1(49.66,82.86) v1(49.66,67.67) v1(49.66,66.85) v1(49.71,48.87) v1(49.71,48.06) v1(49.81,73.46) v1(49.81,72.64) v1(50.21,38.41) v1(50.21,37.59) v1(50.21,35.46) v1(50.21,34.65) v1(50.42,42.01) v1(50.42,41.2) v1(50.57,83.67) v1(50.57,82.86) v1(50.57,67.67) v1(50.57,66.85) v1(50.62,48.87) v1(50.62,48.06) v1(53.72,78.84) v1(53.97,73.61) v1(53.97,72.8) v1(54.89,73.61) v1(54.89,72.8) v1(55.7,61.82) v1(55.85,58.52) v1(59,33.22) v1(59,32.41) v1(59.97,77.98) v1(59.92,33.22) v1(59.92,32.41) v1(61.59,13.51) v1(61.59,12.7) v1(62.25,79.25) v1(62.51,13.51) v1(62.51,12.7) v1(63.27,76.71) v1(65.56,33.48) v1(65.56,32.66) v1(66.06,21.13) v1(66.06,20.32) v1(66.47,33.48) v1(66.47,32.66) v1(66.98,21.13) v1(66.98,20.32) v1(68.5,78.44) v1(68.6,12.19) v1(68.6,11.38) v1(69.52,12.19) v1(69.52,11.38) v1(71.04,27.48) v1(71.04,26.67) v1(71.96,27.48) v1(71.96,26.67) v1(72.36,68.02) v1(72.36,67.21) v1(72.47,83.41) v1(72.47,82.6) v1(73.28,68.02) v1(73.28,67.21) v1(73.38,83.41) v1(73.38,82.6) v1(77.75,83.41) v1(77.75,82.6) v1(78.1,50.6) v1(78.1,49.78) v1(78.66,83.41) v1(78.66,82.6) v1(79.02,50.6) v1(79.02,49.78) v1(79.53,22.73) v1(79.65,44.83) v1(80.8,67.72) v1(80.8,66.9) v1(81.15,79.4) v1(81.15,78.59) v1(81.71,67.72) v1(81.71,66.9) v1(82.07,79.4) v1(82.07,78.59) v1(82.19,34.54) v1(83.08,62.23) v1(83.08,61.42) v1(84,62.23) v1(84,61.42) v1(84,55.73) v1(84,54.92) v1(84.91,55.73) v1(84.91,54.92)
VBAT: length 8.1
  Top Layer w0.254: 65.64,38.22 65.39,37.97 H9.1
AO1: length 5.3
  Top Layer w0.254: H7.1 91.92,40.58 P2.4
AO2: length 5.3
  Top Layer w0.254: P2.5 91.92,43.12 H7.2
BO1: length 5.3
  Top Layer w0.254: H7.4 91.92,48.2 P2.7
BO2: length 5.3
  Top Layer w0.254: H7.3 91.92,45.66 P2.6
NRST: length 8.1
  Top Layer w0.254: H9.17 65.39,78.61 65.64,78.86
PA0: length 24.8
  Top Layer w0.254: M14.2 68.99,35.56 67.59,36.96 67.59,46.44 65.64,48.38 65.39,48.13 H9.5
PA1: length 109.5
  Top Layer w0.254: v1(44.68,69.75) 53.82,69.75 54.89,68.68 v1(54.89,50.75) ; 65.64,50.92 65.39,50.67 H9.6
  Bottom Layer w0.254: H9.6 57.57,50.75 v1(54.89,50.75) ; v1(44.68,69.75) 32.08,69.75 30.2,71.63 M2.2 ; M10.2 71.02,70.74 70.18,69.9 70.18,51.36 69.74,50.92 65.64,50.92
PA2: length 86.5
  Top Layer w0.254: 65.64,53.46 65.39,53.21 H9.7 ; M3.3 10.34,48.51 11.66,49.83 11.66,55.27 12.32,55.93 23.19,55.93 24.71,57.45 24.71,62.74 23.95,63.5 H6.3 ; v1(44.47,64.72) 52.91,64.72 53.67,63.96 v1(53.67,53.24)
  Bottom Layer w0.254: 44.6,64.57 44.43,64.73 22.85,64.73 22.38,64.26 H6.3 22.38,63.42 ; v1(53.67,53.24) 57.62,53.24 H9.7
PA3: length 57.2
  Top Layer w0.254: v1(69.16,55.83) 71.25,55.83 v1(71.3,55.78) ; H9.8 65.39,55.75 65.64,56
  Bottom Layer w0.254: M7.4 80.67,53.32 78.21,55.78 v1(71.3,55.78) ; v1(69.16,55.83) 65.82,55.83 65.64,56
PA4: length 33.4
  Top Layer w0.254: H9.9 65.39,58.29 65.64,58.54 67.72,58.54 68.35,57.91 68.35,39.12 69.37,38.1 M14.3
PA5: length 47.4
  Top Layer w0.254: v1(50.37,57.15) 44.83,57.15 v1(44.78,57.1) ; 65.64,61.08 65.39,60.83 H9.10
  Bottom Layer w0.254: M12.2 32.66,55.47 32.66,56.77 32.92,57.02 44.47,57.02 44.55,57.1 v1(44.78,57.1) ; v1(50.37,57.15) 53.62,57.15 54.53,58.06 54.53,60.55 54.81,60.83 H9.10
PA6: length 59.9
  Top Layer w0.254: v1(44.47,51.92) v1(49.91,51.92) ; H9.11 65.39,63.37 65.64,63.62
  Bottom Layer w0.254: 49.81,51.92 49.86,51.97 49.86,55.58 50.27,55.98 53.87,55.98 54.89,57 58.85,57 59.87,58.01 59.87,63.04 59.54,63.37 H9.11 ; M12.4 27.46,45.18 27.46,48.51 30.86,51.92 v1(44.47,51.92)
PA7: length 49.4
  Top Layer w0.254: 65.64,66.16 65.39,65.91 H9.12 ; v1(49.1,59.59) 44.75,59.59 v1(44.73,59.56)
  Bottom Layer w0.254: H9.12 54.05,65.91 53.72,65.58 53.72,60.91 52.4,59.59 v1(49.1,59.59) ; v1(44.73,59.56) 33.49,59.56 25.68,51.75 M12.1
PA8: length 146.2
  Top Layer w0.254: v1(50.16,75.95) 42.53,75.95 H10.16 34.65,76.07 34.4,76.32 ; v1(50.16,79.91) 50.52,79.91 50.54,79.88 76.86,79.88 78.71,78.03 v1(78.71,69.34) ; v1(23.04,49.33) 23.04,54.15 25.68,56.79 25.68,76 v1(25.73,76.05) ; M4.1 17.72,30.52 18.57,31.37 v1(18.57,37.21)
  Bottom Layer w0.254: v1(50.16,75.95) v1(50.16,79.91) ; v1(18.57,37.21) 18.57,47.95 19.94,49.33 v1(23.04,49.33) ; v1(25.73,76.05) 34.13,76.05 34.4,76.32 ; M9.2 80.36,57.02 78.71,58.67 v1(78.71,69.34)
PA9: length 8.1
  Top Layer w0.254: H10.15 34.65,73.53 34.4,73.78
PA10: length 8.1
  Top Layer w0.254: 34.4,71.24 34.65,70.99 H10.14
PA11: length 8.1
  Top Layer w0.254: 34.4,68.7 34.65,68.45 H10.13
PA12: length 8.1
  Top Layer w0.254: H10.12 34.65,65.91 34.4,66.16
PA15: length 49.3
  Top Layer w0.254: M3.1 8.66,60.2 H4.3 ; 34.4,63.62 34.65,63.37 H10.11
  Bottom Layer w0.254: M3.1 19.73,53.59 29.77,63.63 34.4,63.63 34.4,63.62
PB0: length 73.5
  Top Layer w0.254: H9.13 65.39,68.45 65.64,68.7
  Bottom Layer w0.254: M13.3 50.06,27.65 50.06,23.42 50.72,22.76 60.58,22.76 62,24.18 62,67.97 61.52,68.45 H9.13
PB1: length 82.3
  Top Layer w0.254: H9.14 65.39,70.99 65.64,71.24
  Bottom Layer w0.254: M13.2 47.48,22.8 48.39,21.9 62.1,21.9 63.27,23.06 63.27,69.55 61.82,70.99 H9.14
PB3: length 67.9
  Top Layer w0.254: 34.4,61.08 34.65,60.83 H10.10 ; M3.2 6.27,51.05 5.74,51.59 5.74,64.24 7.42,65.91 16.46,65.91 17.17,65.2 H5.3
  Bottom Layer w0.254: M3.2 21.61,51.05 31.65,61.09 34.4,61.09 34.4,61.08
PB4: length 82.8
  Top Layer w0.254: 34.4,58.54 34.65,58.29 H10.9 42.53,58.17 v1(48.34,58.17) ; v1(54.89,30.58) v1(66.88,30.58)
  Bottom Layer w0.254: M14.5 74.24,43.18 75,42.42 75,31.14 74.45,30.58 v1(66.88,30.58) ; v1(54.89,30.58) 54.84,30.63 54.84,45.52 54.28,46.08 49.25,46.08 48.34,46.99 v1(48.34,58.17)
PB5: length 81.7
  Top Layer w0.254: 34.4,56 34.65,55.75 H10.8 42.43,55.78 v1(47.17,55.78)
  Bottom Layer w0.254: v1(47.17,55.78) 47.17,88.16 49.17,90.17 69.87,90.17 74.06,85.98 M11.1
PB6: length 105.3
  Top Layer w0.254: 29.52,82.91 29.52,87.85 28.73,88.65 M1.3 ; H10.7 34.65,53.21 34.4,53.46
  Bottom Layer w0.254: 45.23,88.65 45.49,88.9 ; 45.23,88.65 45.45,88.65 45.49,88.61 ; 45.23,88.65 45.49,88.39 ; 45.23,88.65 M1.3 ; 45.49,88.9 45.49,91.57 46.25,92.33 M11.6 ; 45.49,88.9 45.49,88.61 ; 45.49,88.61 45.49,88.39 ; 45.49,88.39 45.49,53.95 44.75,53.21 H10.7
PB7: length 143
  Top Layer w0.254: M11.5 72.2,93.29 67.43,96.05 34.73,96.05 31.55,92.86 26.08,92.86 22.63,89.41 M1.4 22.63,84.43 24.15,82.91 27.93,82.91 ; H10.6 34.65,50.67 34.4,50.92
  Bottom Layer w0.254: M11.5 47.52,91.06 46.25,89.79 46.25,51.94 44.98,50.67 H10.6
PB8: length 64.2
  Top Layer w0.254: H10.5 34.65,48.13 34.4,48.38
  Bottom Layer w0.254: M6.3 51.17,7.12 49.71,8.59 43.2,8.59 42.59,9.19 42.59,28.96 45.59,31.95 45.59,47.3 44.75,48.13 H10.5
PB9: length 77.7
  Top Layer w0.254: H10.4 34.65,45.59 34.4,45.84
  Bottom Layer w0.254: 28.21,40.86 28.6,40.86 ; 28.21,40.86 M12.5 ; 28.21,40.86 arc(28.49,40.75) 28.6,40.47 ; 28.6,40.86 28.62,40.86 28.6,40.84 ; 28.6,40.86 28.6,40.84 ; 28.6,40.86 28.6,44.45 29.76,45.61 J2.4 ; 28.6,40.47 28.6,9.02 30.25,7.37 47.01,7.37 48.54,5.84 48.54,3.39 48.63,3.3 48.18,3.3 ; 28.6,40.47 28.6,40.84
PB10: length 70.3
  Top Layer w0.254: v1(76.83,73.66) v1(76.83,68.83) ; 65.64,73.78 65.39,73.53 H9.15
  Bottom Layer w0.254: 65.64,73.78 65.77,73.66 v1(76.83,73.66) ; v1(76.83,68.83) 76.83,58.72 83.59,51.97 M8.1
PB11: length 75.1
  Top Layer w0.254: H9.16 65.39,76.07 65.64,76.32 ; v1(74.7,58.22) 74.7,50.17 v1(74.83,50.04) ; v1(74.7,65.79) 74.7,74.83 73.63,75.89 v1(71.7,75.89)
  Bottom Layer w0.254: v1(74.83,50.04) 78.47,46.4 78.47,19.05 ; v1(74.7,65.79) v1(74.7,58.22) ; 65.64,76.32 65.89,76.07 71.53,76.07 v1(71.7,75.89)
PB12: length 76.1
  Top Layer w0.254: 52.56,55.77 M13.4 ; 52.56,55.77 52.55,55.78 ; 52.56,55.77 52.56,62.98 v1(52.4,63.14) ; 34.4,86.48 34.65,86.23 H10.20 51.26,86.23 52.4,85.09 v1(52.4,80.77)
  Bottom Layer w0.254: v1(52.4,80.77) v1(52.4,63.14)
PB13: length 82.3
  Top Layer w0.254: 34.65,83.69 H10.19 ; v1(27.81,78.49) v1(27.81,55.73)
  Bottom Layer w0.254: v1(27.81,55.73) 23.81,51.73 M5.3 ; v1(27.81,78.49) 27.81,82.65 29.1,83.94 34.4,83.94
PB14: length 70.2
  Top Layer w0.254: R3.1 84.17,59.34 SW1.1 SW1.2 70.17,59.34 69.62,59.89 69.62,76.01 68.29,77.34 48.51,77.34 47.98,77.88 47.98,80.72 47.55,81.15 H10.18 42.4,81.15 34.66,81.15 34.4,81.4
PB15: length 110.7
  Top Layer w0.254: v1(51.38,55.02) v1(51.38,62.99) ; 34.4,78.86 34.65,78.61 H10.17 44.4,78.61 44.63,78.38 44.63,77.01 44.98,76.66 v1(51.38,76.66) ; v1(66.78,29.52) v1(55.9,29.52)
  Bottom Layer w0.254: v1(51.38,55.02) 51.38,49.68 51.66,49.4 54.96,49.4 55.9,48.46 v1(55.9,29.52) ; M14.6 75.87,45.72 76.48,45.11 76.48,30.17 75.82,29.52 v1(66.78,29.52) ; v1(51.38,62.99) v1(51.38,76.66)
PC13: length 8.1
  Top Layer w0.254: 65.64,40.76 65.39,40.51 H9.2
PC14: length 8.1
  Top Layer w0.254: H9.3 65.39,43.05 65.64,43.3
PC15: length 8.1
  Top Layer w0.254: H9.4 65.39,45.59 65.64,45.84

## Copper pours and planes (outline as drawn; the poured copper is in the pictures)
GND on Top Layer: 0.02,100 100.02,100 100.02,0 0.02,0
GND on Bottom Layer: 0.02,100 100.02,100 100.02,0 0.02,0

Small or netless copper shapes (teardrops, artwork), in the pictures only: 212 on Top Layer, 83 on Bottom Layer

## Text on the board
Top Silkscreen Layer: PB14 | PB12 | PB13 | PB15 | PA8 | PA9 | PA10 | PA11 | PA12 | PA15 | PB3 | PB4 | PB5 | PB6 | PB7 | PB8 | PB9 | 5V | 3.3V | GND | NRST | PB11 | PB10 | PB1 | PB0 | PA7 | PA6 | PA5 | PA4 | PA3 | PA2 | PA1 | PA0 | PC15 | PC14 | PC13 | VBAT | BO1 | BO2 | AO2 | AO1 | OLED(SSD1306) | DS18B20 | K1 | 舵机1 | 舵机2 | 舵机3 | 红外对管避障模块 | 红外发射管(IR Transmitter) | DHT11温湿度模块 | 陀螺仪加速度计 | Flash模块 | 旋转编码器 | 核心板 | 直流电机驱动板 | Motor | 光敏电阻模块 | 红外接收管 / (IR Receiver) | 超声波模块 | 全彩LED | 蜂鸣器 | DshanMCU—F103 | Base Boord
